# Altium project Impact.PrjPcb
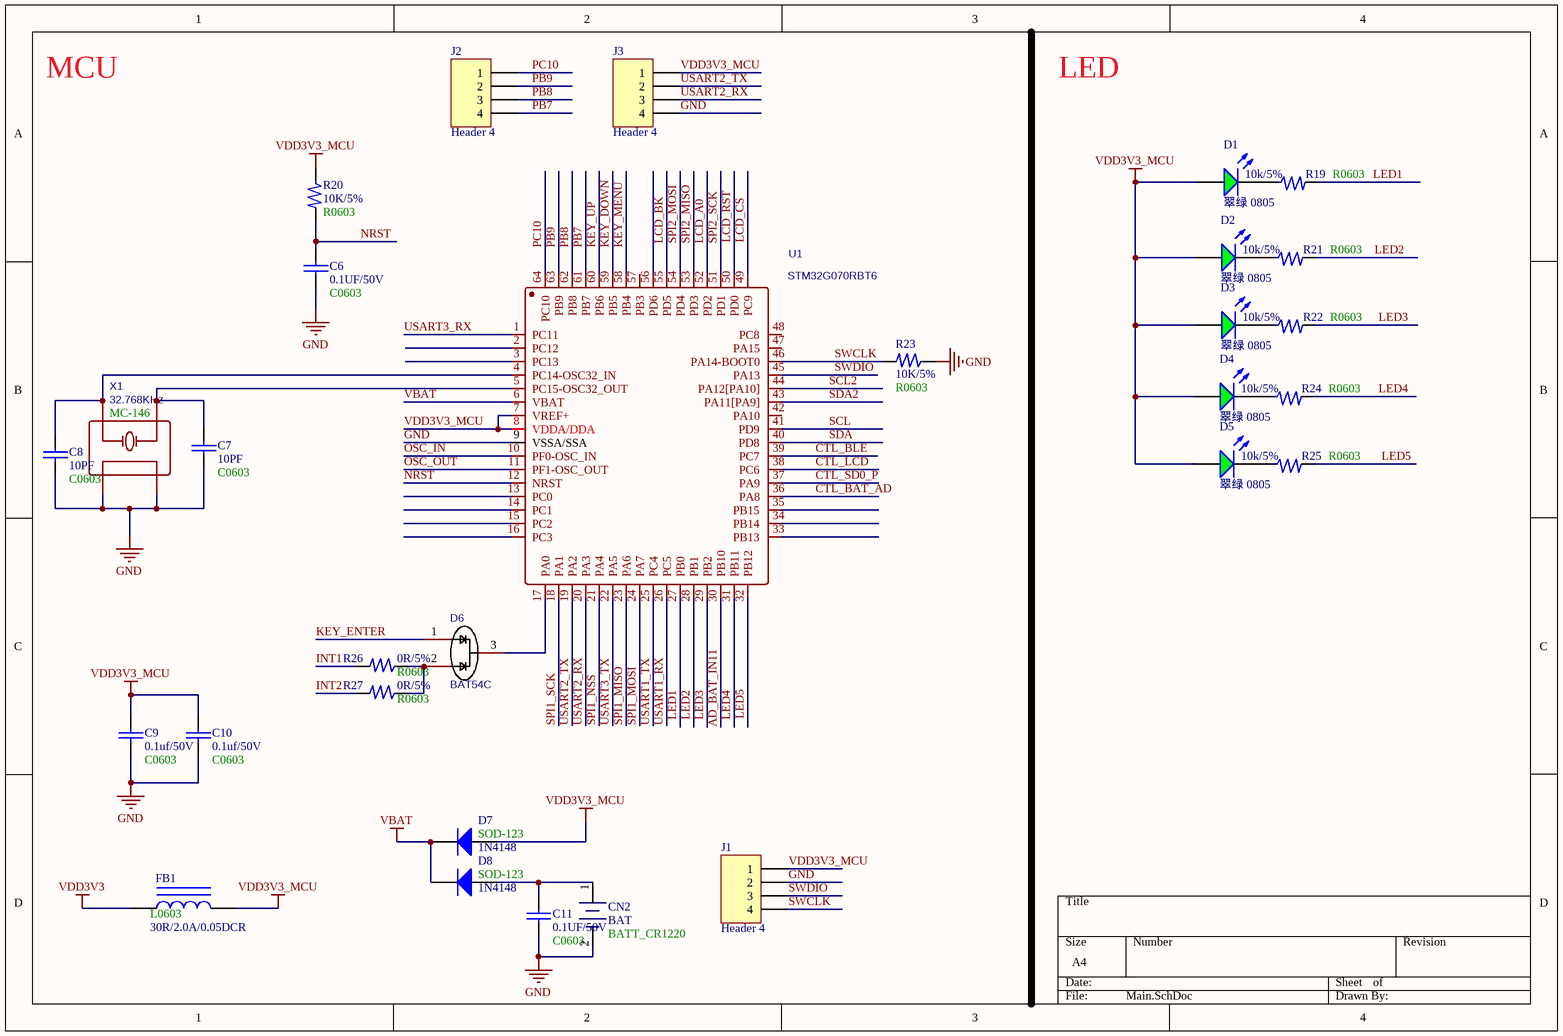
[diagram p0: Main.SchDoc]
5 sheets, 108 parts. Net scope: global (net labels, ports and power ports of the same name join across sheets).
Board file: Impact.PcbDoc
Sheets:
  Main.SchDoc
  Sensor.SchDoc
  TF.SchDoc
  Power.SchDoc
  LCD.SchDoc

## Sheet Main.SchDoc
size A4

### Parts
C6  0.1UF/50V  Footprint: C0603  [0603_C]
C7  10PF  Footprint: C0603  [0603_C]
C8  10PF  Footprint: C0603  [0603_C]
C9  0.1uf/50V  Footprint: C0603  [0603_C]
C10  0.1uf/50V  Footprint: C0603  [0603_C]
C11  0.1UF/50V  Footprint: C0603  [0603_C]
CN2  BAT  Footprint: BATT_CR1220  [BATS]
D1  翠绿 0805  [0805_LED_S1]
D2  翠绿 0805  [0805_LED_S1]
D3  翠绿 0805  [0805_LED_S1]
D4  翠绿 0805  [0805_LED_S1]
D5  翠绿 0805  [0805_LED_S1]
D6  BAT54C  [SOT-23(SOT-23-3)]
D7  1N4148  [SOD-123]
D8  1N4148  [SOD-123]
FB1  30R/2.0A/0.05DCR  Package: L0603  [0603_L]
J1  Header 4  [CON4-2.0]
J2  Header 4  [HDR1X4]
J3  Header 4  [HDR1X4]
R19  10k/5%  Footprint: R0603  [0603_R]
R20  10K/5%  Footprint: R0603  [0603_R]
R21  10k/5%  Footprint: R0603  [0603_R]
R22  10k/5%  Footprint: R0603  [0603_R]
R23  10K/5%  Footprint: R0603  [0603_R]
R24  10k/5%  Footprint: R0603  [0603_R]
R25  10k/5%  Footprint: R0603  [0603_R]
R26  0R/5%  Footprint: R0603  [0603_R]
R27  0R/5%  Footprint: R0603  [0603_R]
U1  STM32G070RBT6  [LQFP-64_L10.0-W10.0-P0.50-LS12.0-BL]
X1  32.768KHz  [MC-146_4P]

### Nets
GND: C6.1 C7.2 C8.2 C9.2 C10.2 C11.1 CN2.2 J1.2 J3.4 R23.2 U1.9(VSSA/SSA) X1.2 X1.3
VBAT: D7.2(K) D8.2(K) U1.6(VBAT)
VDD3V3: FB1.1
VDD3V3_MCU: C9.1 C10.1 D1.A D2.A D3.A D4.A D5.A D7.1(A) FB1.2 J1.1 J3.1 R20.2 U1.7(VREF+) U1.8(VDDA/DDA)
AD_BAT_IN11: U1.30(PB10)
CTL_BAT_AD: U1.36(PA8)
CTL_BLE: U1.39(PC7)
CTL_LCD: U1.38(PC6)
CTL_SD0_P: U1.37(PA9)
INT1: R26.1
INT2: R27.1
KEY_DOWN: U1.59(PB5)
KEY_ENTER: D6.1
KEY_MENU: U1.58(PB4)
KEY_UP: U1.60(PB6)
LCD_A0: U1.52(PD2)
LCD_BK: U1.55(PD5)
LCD_CS: U1.49(PC9)
LCD_RST: U1.50(PD0)
LED1: R19.1 U1.27(PB0)
LED2: R21.1 U1.28(PB1)
LED3: R22.1 U1.29(PB2)
LED4: R24.1 U1.31(PB11)
LED5: R25.1 U1.32(PB12)
NRST: C6.2 R20.1 U1.12(NRST)
OSC_IN: U1.10(PF0-OSC_IN)
OSC_OUT: U1.11(PF1-OSC_OUT)
PB7: J2.4 U1.61(PB7)
PB8: J2.3 U1.62(PB8)
PB9: J2.2 U1.63(PB9)
PC10: J2.1 U1.64(PC10)
SCL: U1.41(PD9)
SCL2: U1.44(PA12[PA10])
SDA: U1.40(PD8)
SDA2: U1.43(PA11[PA9])
SPI1_MISO: U1.23(PA6)
SPI1_MOSI: U1.24(PA7)
SPI1_NSS: U1.21(PA4)
SPI1_SCK: U1.18(PA1)
SPI2_MISO: U1.53(PD3)
SPI2_MOSI: U1.54(PD4)
SPI2_SCK: U1.51(PD1)
SWCLK: J1.4 R23.1 U1.46(PA14-BOOT0)
SWDIO: J1.3 U1.45(PA13)
USART1_RX: U1.26(PC5)
USART1_TX: U1.25(PC4)
USART2_RX: J3.3 U1.20(PA3)
USART2_TX: J3.2 U1.19(PA2)
USART3_RX: U1.1(PC11)
USART3_TX: U1.22(PA5)
NetC7_1: C7.1 U1.5(PC15-OSC32_OUT) X1.4(OSC2)
NetC8_1: C8.1 U1.4(PC14-OSC32_IN) X1.1(OSC1)
NetC11_2: C11.2 CN2.1 D8.1(A)
NetD1_K: D1.K R19.2
NetD2_K: D2.K R21.2
NetD3_K: D3.K R22.2
NetD4_K: D4.K R24.2
NetD5_K: D5.K R25.2
NetD6_2: D6.2 R26.2 R27.2
NetD6_3: D6.3 U1.17(PA0)

Not connected (* = marked no-connect by the designer): U1 2(PC12) 3(PC13) 13(PC0) 14(PC1) 15(PC2) 16(PC3) 33(PB13) 34(PB14) 35(PB15) 42(PA10) 47(PA15) 48(PC8) 56(PD6) 57(PB3)

### Notes on the sheet
- MCU
- LED
- (in symbol 32.768KHz) MC-146

### Library data of the parts
C6-C11 = CAP: Capacitor
D1-D5 = 0805 翠绿: 发光二极管; ComponentLink1Description: 供应商链接; ComponentLink1URL: http://www.szlcsc.com/product/details_2670.html; Package: 0805; Supplier: LC; SuppliersPartNumber: C2297
D6 = BAT54CW: Manufacturer: CJ（江苏长电/长晶）; Add into BOM: yes; Reverse Voltage (Vr): 30V; Average Rectified Current (Io): 200mA; Forward Voltage (Vf@If): 1V@100mA; Name: BAT54CW; Symbol: BAT54CW; Device: BAT54CW; LCSC Part Name: 30V 200mA 1V@100mA; Supplier Part: C77321; Manufacturer Part: BAT54CW; Supplier Footprint: SOT-323(SC-70); JLCPCB Part Class: Extended Part; Datasheet: https://atta.szlcsc.com/upload/public/pdf/source/20160702/1467448302669.pdf; Supplier: LCSC; Convert to PCB: yes
D7 D8 = SOD-123 B5819W  SL: 肖特基二极管; ComponentLink1Description: 供应商链接; ComponentLink1URL: http://www.szlcsc.com/product/details_9093.html; Package: SOD-123; Supplier: LC; SuppliersPartNumber: C8598
FB1 = 0603 3.9nH 0.3nH: 贴片电感; ComponentLink1Description: 供应商链接; ComponentLink1URL: http://www.szlcsc.com/product/details_14473.html; Supplier: LC; SuppliersPartNumber: C13818
J1-J3 = Header 4: Header, 4-Pin; LatestRevisionDate: 17-Jul-2002; LatestRevisionNote: Re-released for DXP Platform.; Publisher: Altium Limited
R19-R27 = 电阻
U1 = STM32G070RBT6: BOM_Manufacturer: STMicroelectronics; Contributor: LCSC; BOM_Supplier: LCSC; BOM_Supplier Part: C529340; BOM_Manufacturer Part: STM32G070RBT6; BOM_JLCPCB Part Class: Extended Part; spicePre: U; spiceSymbolName: STM32G070RBT6
X1 = 32.768KHz: BOM_Manufacturer: EPSON; BOM_Manufacturer Part: MC-14632.768kHz7.0pF20PPM; nameAlias: Frequency; Contributor: LCSC; SMT Type: Extend; BOM_Supplier: LCSC; BOM_Supplier Part: C94977; BOM_JLCPCB SMD: Yes; spicePre: X; spiceSymbolName: MC-14632.768kHz7.0pF20PPM

## Sheet Sensor.SchDoc
size A4
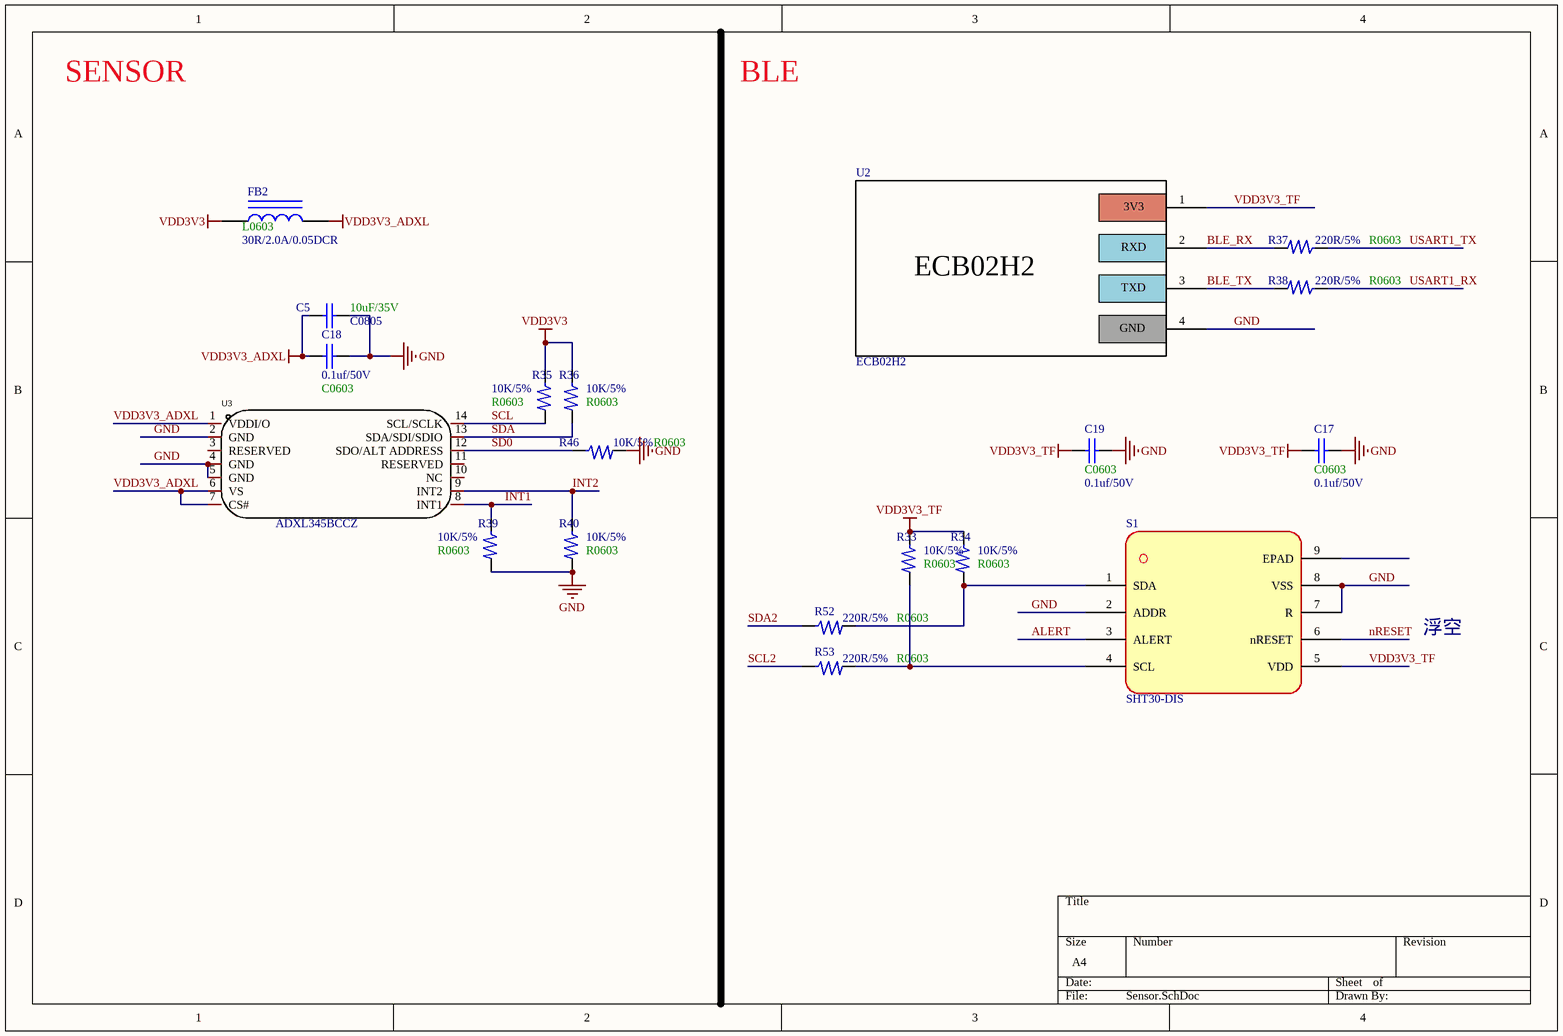
[diagram p1: Sensor.SchDoc]

### Parts
C5  10uF/35V  value C0805  [0805_C]
C17  C0603  value 0.1uf/50V  [0603_C]
C18  0.1uf/50V  Footprint: C0603  [0603_C]
C19  C0603  value 0.1uf/50V  [0603_C]
FB2  30R/2.0A/0.05DCR  Package: L0603  [0603_L]
R33  10K/5%  Footprint: R0603  [0603_R]
R34  10K/5%  Footprint: R0603  [0603_R]
R35  10K/5%  Footprint: R0603  [0603_R]
R36  10K/5%  Footprint: R0603  [0603_R]
R37  220R/5%  Footprint: R0603  [0603_R]
R38  220R/5%  Footprint: R0603  [0603_R]
R39  10K/5%  Footprint: R0603  [0603_R]
R40  10K/5%  Footprint: R0603  [0603_R]
R46  10K/5%  Footprint: R0603  [0603_R]
R52  220R/5%  Footprint: R0603  [0603_R]
R53  220R/5%  Footprint: R0603  [0603_R]
S1  SHT30-DIS  [DFN-8]
U2  ECB02H2  [HDR1X4]
U3  ADXL345BCCZ  [LGA-14_L5.0-W3.0-P0.80-BL]

### Nets
GND: C5.2 C17.1 C18.2 C19.1 R39.1 R40.1 R46.1 S1.2(ADDR) S1.7(R) S1.8(VSS) U2.4 U3.2(GND) U3.4(GND) U3.5(GND)
VDD3V3: FB2.1 R35.2 R36.2
VDD3V3_ADXL: C5.1 C18.1 FB2.2 U3.1(VDDI/O) U3.6(VS) U3.7(CS#)
VDD3V3_TF: C17.2 C19.2 R33.2 R34.2 S1.5(VDD) U2.1
ALERT: S1.3(ALERT)
BLE_RX: R37.1 U2.2
BLE_TX: R38.1 U2.3
INT1: R39.2 U3.8(INT1)
INT2: R40.2 U3.9(INT2)
nRESET: S1.6(nRESET)
SCL: R35.1 U3.14(SCL/SCLK)
SCL2: R53.2
SD0: R46.2 U3.12(SDO/ALT_ADDRESS)
SDA: R36.1 U3.13(SDA/SDI/SDIO)
SDA2: R52.2
USART1_RX: R38.2
USART1_TX: R37.2
NetR33_1: R33.1 R53.1 S1.4(SCL)
NetR34_1: R34.1 R52.1 S1.1(SDA)

Not connected (* = marked no-connect by the designer): S1 9(EPAD); U3 3(RESERVED) 10(NC) 11(RESERVED)

### Notes on the sheet
- SENSOR
- BLE
- 浮空
- (in symbol ECB02H2) 3V3; RXD; TXD; GND

### Library data of the parts
C5 = CAP
C17 C19 = CAP: 0.1uf/50V
C18 = CAP: Capacitor
FB2 = 0603 3.9nH 0.3nH: 贴片电感; ComponentLink1Description: 供应商链接; ComponentLink1URL: http://www.szlcsc.com/product/details_14473.html; Supplier: LC; SuppliersPartNumber: C13818
R33-R40 R46 R52 R53 = 电阻
S1 = SHT30-DIS-B
U3 = ADXL345BCCZ: Manufacturer: ADI(亚德诺)/LINEAR; Add into BOM: yes; Name: ADXL345BCCZ; Symbol: ADXL345BCCZ; Device: ADXL345BCCZ; LCSC Part Name: 加速度计 ADXL345BCCZ; Supplier Part: C579456; Manufacturer Part: ADXL345BCCZ; Supplier Footprint: LGA-14; JLCPCB Part Class: Extended Part; Datasheet: https://atta.szlcsc.com/upload/public/pdf/source/20201030/C579456_55C163C42E67F11674CE9C462EA8849E.pdf; Supplier: LCSC; Convert to PCB: yes

## Sheet TF.SchDoc
size A4
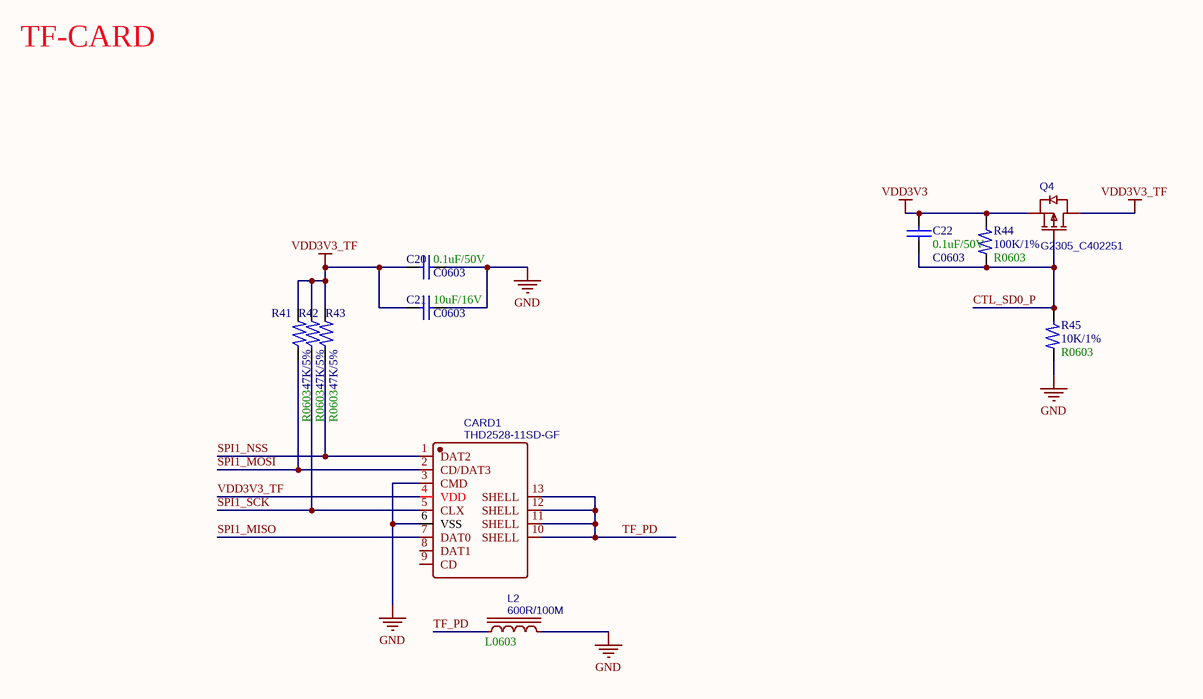
[diagram p2: TF.SchDoc]

### Parts
C20  0.1uF/50V  value C0603  [0603_C]
C21  10uF/16V  value C0603  [0603_C]
C22  0.1uF/50V  value C0603  [0603_C]
CARD1  THD2528-11SD-GF  [TF-SMD_THD2528-11SD-GF]
L2  600R/100M  [0603_L]
Q4  G2305_C402251  [SOT-23-3L]
R41  47K/5%  Footprint: R0603  [0603_R]
R42  47K/5%  Footprint: R0603  [0603_R]
R43  47K/5%  Footprint: R0603  [0603_R]
R44  100K/1%  Footprint: R0603  [0603_R]
R45  10K/1%  Footprint: R0603  [0603_R]

### Nets
GND: C20.2 C21.2 CARD1.3(CMD) CARD1.6(VSS) L2.2 R45.1
VDD3V3: C22.1 Q4.2(S) R44.2
VDD3V3_TF: C20.1 C21.1 CARD1.4(VDD) Q4.3(D) R41.1 R42.1 R43.1
CTL_SD0_P: C22.2 Q4.1(G) R44.1 R45.2
SPI1_MISO: CARD1.7(DAT0)
SPI1_MOSI: CARD1.2(CD/DAT3) R41.2
SPI1_NSS: CARD1.1(DAT2) R43.2
SPI1_SCK: CARD1.5(CLX) R42.2
TF_PD: CARD1.10(SHELL) CARD1.11(SHELL) CARD1.12(SHELL) CARD1.13(SHELL) L2.1

Not connected (* = marked no-connect by the designer): CARD1 8(DAT1) 9(CD)

### Notes on the sheet
- TF-CARD
- (in symbol SCBM160808U600T) L0603

### Library data of the parts
C20-C22 = CAP: Capacitor
CARD1 = THD2528-11SD-GF: BOM_Manufacturer: THD; Contributor: LCSC; BOM_Supplier: LCSC; BOM_Supplier Part: C283232; BOM_Manufacturer Part: THD2528-11SD-GF; BOM_JLCPCB Part Class: Extended Part; spicePre: C; spiceSymbolName: THD2528-11SD-GF
L2 = SCBM160808U600T: BOM_Manufacturer: Yanchuang; Contributor: LCSC; BOM_Supplier: LCSC; BOM_Supplier Part: C494701; BOM_Manufacturer Part: SCBM160808U600T; spicePre: L; spiceSymbolName: SCBM160808U600T
Q4 = G2305_C402251: BOM_Manufacturer: LGE; BOM_Manufacturer Part: G2305; Contributor: LCSC; BOM_Supplier: LCSC; BOM_Supplier Part: C402251; BOM_JLCPCB Part Class: Extended Part; spicePre: Q; spiceSymbolName: G2305_C402251
R41-R45 = 电阻

## Sheet Power.SchDoc
size A4
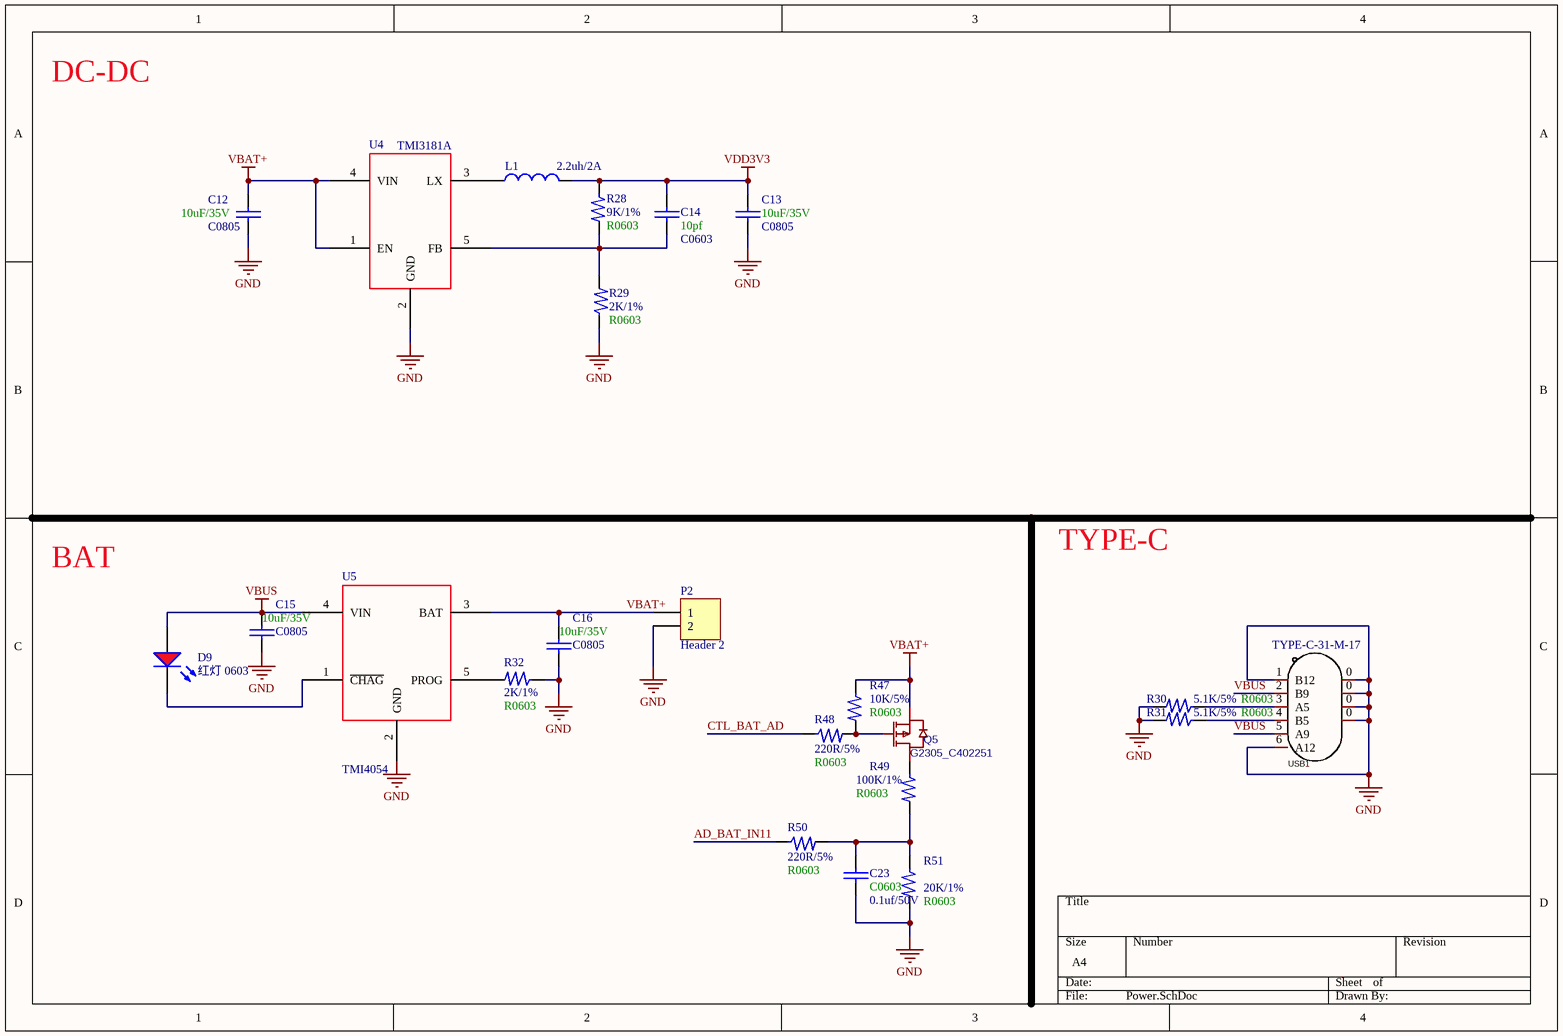
[diagram p3: Power.SchDoc]

### Parts
C12  10uF/35V  value C0805  [0805_C]
C13  10uF/35V  value C0805  [0805_C]
C14  10pf  value C0603  [0603_C]
C15  10uF/35V  value C0805  [0805_C]
C16  10uF/35V  value C0805  [0805_C]
C23  C0603  value 0.1uf/50V  [0603_C]
D9  红灯 0603  [0603_LED_S1]
L1  2.2uh/2A  [IND-SMD_L3.0-W3.0]
P2  Header 2  [CONN-TH_2P-P2.50_XH-2AW]
Q5  G2305_C402251  [SOT-23-3L]
R28  9K/1%  Footprint: R0603  [0603_R]
R29  2K/1%  Footprint: R0603  [0603_R]
R30  5.1K/5%  Footprint: R0603  [0603_R]
R31  5.1K/5%  Footprint: R0603  [0603_R]
R32  2K/1%  Footprint: R0603  [0603_R]
R47  10K/5%  Footprint: R0603  [0603_R]
R48  220R/5%  Footprint: R0603  [0603_R]
R49  100K/1%  Footprint: R0603  [0603_R]
R50  220R/5%  Footprint: R0603  [0603_R]
R51  20K/1%  Footprint: R0603  [0603_R]
U4  TMI3181A  [SOT-23-5]
U5  TMI4054  [SOT-23-5]
USB1  TYPE-C-31-M-17  [USB-C-SMD_10P-P1.00-L6.8-W8.9]

### Nets
GND: C12.2 C13.2 C15.2 C16.2 C23.2 P2.2 R29.2 R30.1 R31.1 R32.2 R51.1 U4.2(GND) U5.2(GND) USB1.0 USB1.1(B12) USB1.6(A12)
VBAT+: C12.1 C16.1 P2.1 Q5.2(S) R47.2 U4.1(EN) U4.4(VIN) U5.3(BAT)
VBUS: C15.1 D9.A U5.4(VIN) USB1.2(B9) USB1.5(A9)
VDD3V3: C13.1 C14.2 L1.1 R28.2
AD_BAT_IN11: R50.2
CTL_BAT_AD: R48.2
NetC14_1: C14.1 R28.1 R29.1 U4.5(FB)
NetC23_1: C23.1 R49.1 R50.1 R51.2
NetD9_K: D9.K U5.1(~{CHAG})
NetL1_2: L1.2 U4.3(LX)
NetQ5_1: Q5.1(G) R47.1 R48.1
NetQ5_3: Q5.3(D) R49.2
NetR30_2: R30.2 USB1.3(A5)
NetR31_2: R31.2 USB1.4(B5)
NetR32_1: R32.1 U5.5(PROG)

### Notes on the sheet
- DC-DC
- BAT
- TYPE-C

### Library data of the parts
C12-C16 = CAP
C23 = CAP: 0.1uf/50V
D9 = 0603 红灯: 发光二极管; ComponentLink1Description: 供应商链接; ComponentLink1URL: http://www.szlcsc.com/product/details_2659.html; Package: 0603; Supplier: LC; SuppliersPartNumber: C2286
L1 = L: Value: *
P2 = Header 2: Header, 2-Pin; LatestRevisionDate: 17-Jul-2002; LatestRevisionNote: Re-released for DXP Platform.; Publisher: Altium Limited
Q5 = G2305_C402251: as Q4 on sheet TF; BOM_Supplier: LCSC; BOM_Supplier Part: C402251; BOM_JLCPCB Part Class: Extended Part; spicePre: Q; spiceSymbolName: G2305_C402251
R28-R32 R47-R51 = 电阻
USB1 = TYPE-C-31-M-17: Manufacturer: 韩国韩荣; Add into BOM: yes; Connector Type: Type-C; Gender: 母座; Number of Contacts: 6; Number of Ports: 1; Name: TYPE-C-31-M-17; Symbol: TYPE-C-31-M-17; Device: TYPE-C-31-M-17; LCSC Part Name: TYPE-C-31-M-17; Supplier Part: C283540; Manufacturer Part: TYPE-C-31-M-17; Supplier Footprint: -; JLCPCB Part Class: Extended Part; Datasheet: https://atta.szlcsc.com/upload/public/pdf/source/20210810/2CA2393895E95C87AA0C31BED5399791.pdf; Supplier: LCSC; Convert to PCB: yes; Standard: -

## Sheet LCD.SchDoc
size A4
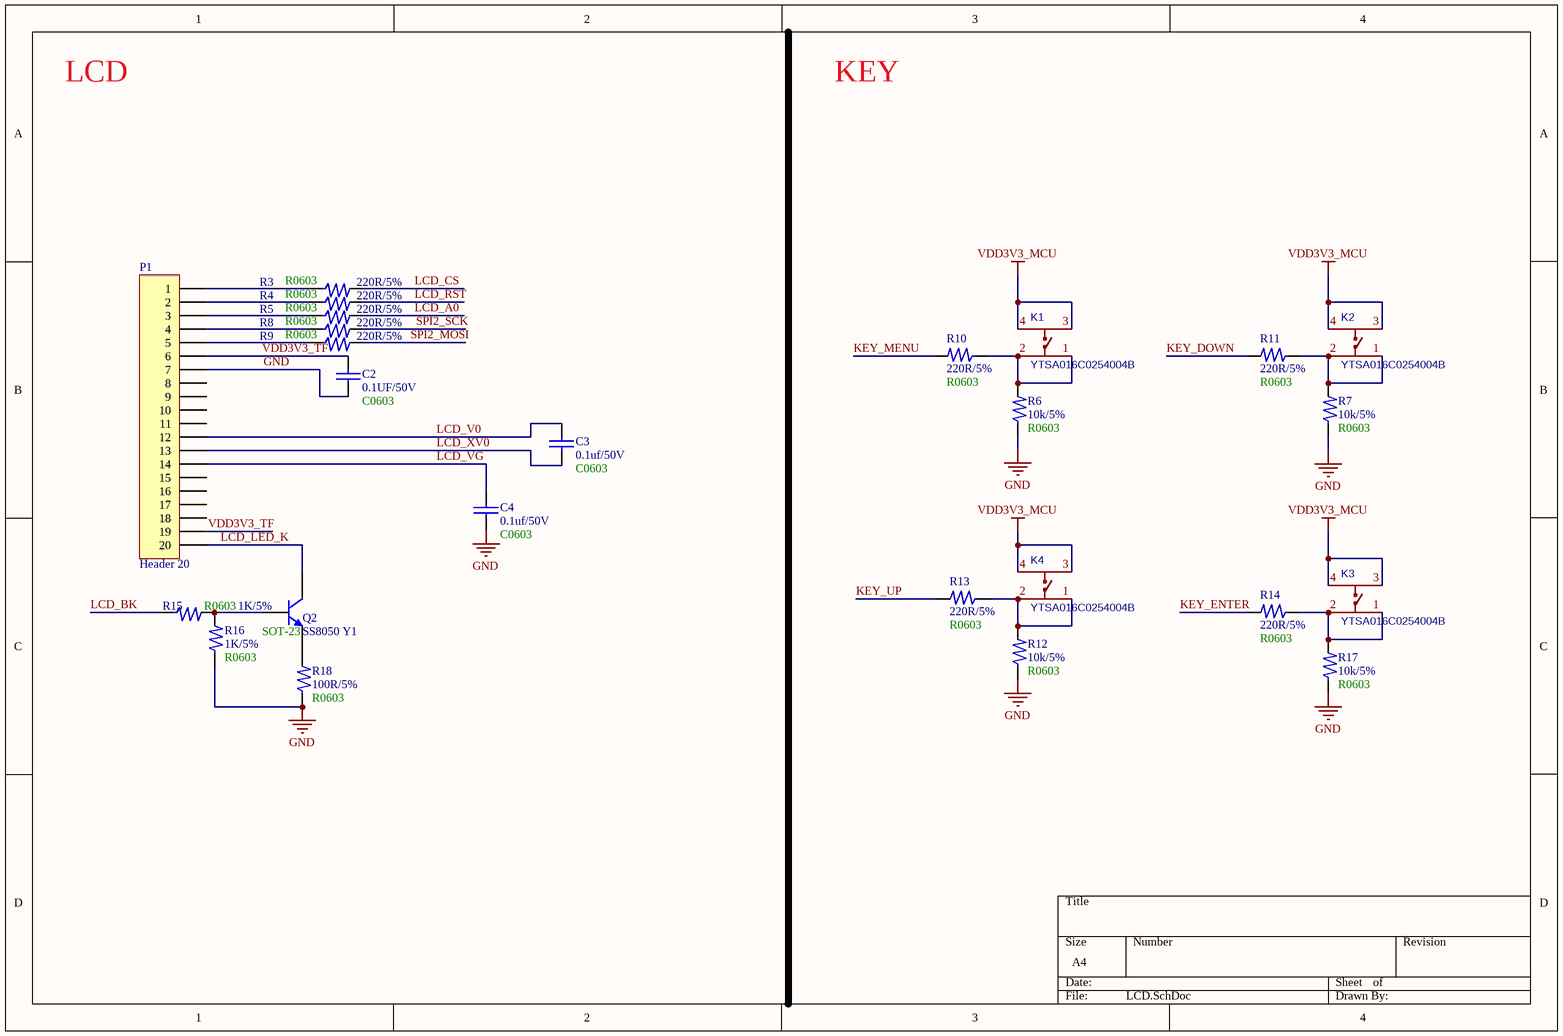
[diagram p4: LCD.SchDoc]

### Parts
C2  0.1UF/50V  Footprint: C0603  [0603_C]
C3  0.1uf/50V  Footprint: C0603  [0603_C]
C4  0.1uf/50V  Footprint: C0603  [0603_C]
K1  YTSA016C0254004B  [SMD6*6*4.5]
K2  YTSA016C0254004B  [SMD6*6*4.5]
K3  YTSA016C0254004B  [SMD6*6*4.5]
K4  YTSA016C0254004B  [SMD6*6*4.5]
P1  Header 20  [LCD]
Q2  SS8050 Y1  Package: SOT-23  [SOT-23(SOT-23-3)]
R3  220R/5%  Footprint: R0603  [0603_R]
R4  220R/5%  Footprint: R0603  [0603_R]
R5  220R/5%  Footprint: R0603  [0603_R]
R6  10k/5%  Footprint: R0603  [0603_R]
R7  10k/5%  Footprint: R0603  [0603_R]
R8  220R/5%  Footprint: R0603  [0603_R]
R9  220R/5%  Footprint: R0603  [0603_R]
R10  220R/5%  Footprint: R0603  [0603_R]
R11  220R/5%  Footprint: R0603  [0603_R]
R12  10k/5%  Footprint: R0603  [0603_R]
R13  220R/5%  Footprint: R0603  [0603_R]
R14  220R/5%  Footprint: R0603  [0603_R]
R15  1K/5%  Footprint: R0603  [0603_R]
R16  1K/5%  Footprint: R0603  [0603_R]
R17  10k/5%  Footprint: R0603  [0603_R]
R18  100R/5%  Footprint: R0603  [0603_R]

### Nets
GND: C2.1 C4.2 P1.7 R6.2 R7.2 R12.2 R16.2 R17.2 R18.2
VDD3V3_MCU: K1.3 K1.4 K2.3 K2.4 K3.3 K3.4 K4.3 K4.4
VDD3V3_TF: C2.2 P1.6 P1.19
KEY_DOWN: R11.1
KEY_ENTER: R14.1
KEY_MENU: R10.1
KEY_UP: R13.1
LCD_A0: R5.1
LCD_BK: R15.2
LCD_CS: R3.1
LCD_LED_K: P1.20 Q2.3(C)
LCD_RST: R4.1
LCD_V0: C3.1 P1.12
LCD_VG: C4.1 P1.14
LCD_XV0: C3.2 P1.13
SPI2_MOSI: R9.1
SPI2_SCK: R8.1
NetK1_1: K1.1 K1.2 R6.1 R10.2
NetK2_1: K2.1 K2.2 R7.1 R11.2
NetK3_1: K3.1 K3.2 R14.2 R17.1
NetK4_1: K4.1 K4.2 R12.1 R13.2
NetP1_1: P1.1 R3.2
NetP1_2: P1.2 R4.2
NetP1_3: P1.3 R5.2
NetP1_4: P1.4 R8.2
NetP1_5: P1.5 R9.2
NetQ2_1: Q2.1(B) R15.1 R16.1
NetQ2_2: Q2.2(E) R18.1

Not connected (* = marked no-connect by the designer): P1 8 9 10 11 15 16 17 18

### Notes on the sheet
- LCD
- KEY

### Library data of the parts
C2-C4 = CAP: Capacitor
K1-K4 = YTSA016C0254004B: BOM_Manufacturer: DGBZ(东莞博众); Contributor: LCSC; BOM_Supplier: LCSC; BOM_Supplier Part: C2764970; BOM_Manufacturer Part: YTSA016C0254004B; BOM_JLCPCB Part Class: Extended Part; spicePre: S; spiceSymbolName: YTSA016C0254004B
P1 = Header 20: Header, 20-Pin; LatestRevisionDate: 17-Jul-2002; LatestRevisionNote: Re-released for DXP Platform.; Publisher: Altium Limited
Q2 = SOT-23 SS8050 Y1: 三极管; ComponentLink1Description: 供应商链接; ComponentLink1URL: http://www.szlcsc.com/product/details_2507.html; Supplier: LC; SuppliersPartNumber: C2150
R3-R18 = 电阻

## Nets that join several sheets
GND: Main (13 pins), Sensor (14 pins), TF (6 pins), Power (16 pins), LCD (9 pins)
VDD3V3: Main (FB1.1), Sensor (FB2.1 R35.2 R36.2), TF (C22.1 Q4.2 R44.2), Power (C13.1 C14.2 L1.1 R28.2)
VDD3V3_MCU: Main (14 pins), LCD (8 pins)
VDD3V3_TF: Sensor (6 pins), TF (7 pins), LCD (C2.2 P1.6 P1.19)
AD_BAT_IN11: Main (U1.30), Power (R50.2)
CTL_BAT_AD: Main (U1.36), Power (R48.2)
CTL_SD0_P: Main (U1.37), TF (C22.2 Q4.1 R44.1 R45.2)
INT1: Main (R26.1), Sensor (R39.2 U3.8)
INT2: Main (R27.1), Sensor (R40.2 U3.9)
KEY_DOWN: Main (U1.59), LCD (R11.1)
KEY_ENTER: Main (D6.1), LCD (R14.1)
KEY_MENU: Main (U1.58), LCD (R10.1)
KEY_UP: Main (U1.60), LCD (R13.1)
LCD_A0: Main (U1.52), LCD (R5.1)
LCD_BK: Main (U1.55), LCD (R15.2)
LCD_CS: Main (U1.49), LCD (R3.1)
LCD_RST: Main (U1.50), LCD (R4.1)
SCL: Main (U1.41), Sensor (R35.1 U3.14)
SCL2: Main (U1.44), Sensor (R53.2)
SDA: Main (U1.40), Sensor (R36.1 U3.13)
SDA2: Main (U1.43), Sensor (R52.2)
SPI1_MISO: Main (U1.23), TF (CARD1.7)
SPI1_MOSI: Main (U1.24), TF (CARD1.2 R41.2)
SPI1_NSS: Main (U1.21), TF (CARD1.1 R43.2)
SPI1_SCK: Main (U1.18), TF (CARD1.5 R42.2)
SPI2_MOSI: Main (U1.54), LCD (R9.1)
SPI2_SCK: Main (U1.51), LCD (R8.1)
USART1_RX: Main (U1.26), Sensor (R38.2)
USART1_TX: Main (U1.25), Sensor (R37.2)